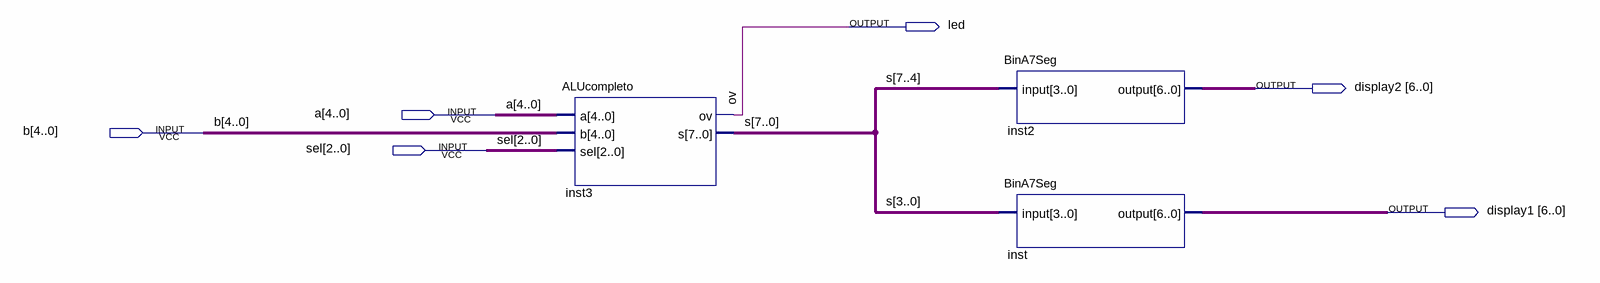
[diagram p0: schematic sheet]
// Quartus schematic Practica7.bdf as structural Verilog: 3 symbols, 6 pins
module Practica7 (
  input  [4:0] a,
  input  [4:0] b,
  input  [2:0] sel,
  output led,
  output [6:0] display2,
  output [6:0] display1
);

  wire [7:0] s;

  ALUcompleto inst3 (.a(a), .b(b), .sel(sel), .ov(led), .s(s));
  BinA7Seg inst2 (.\input (s[7:4]), .\output (display2));
  BinA7Seg inst (.\input (s[3:0]), .\output (display1));

  // Other names for the same wires on the sheet: ov = led
endmodule
